# Altium project PX Logic to DS cable.PrjPcb
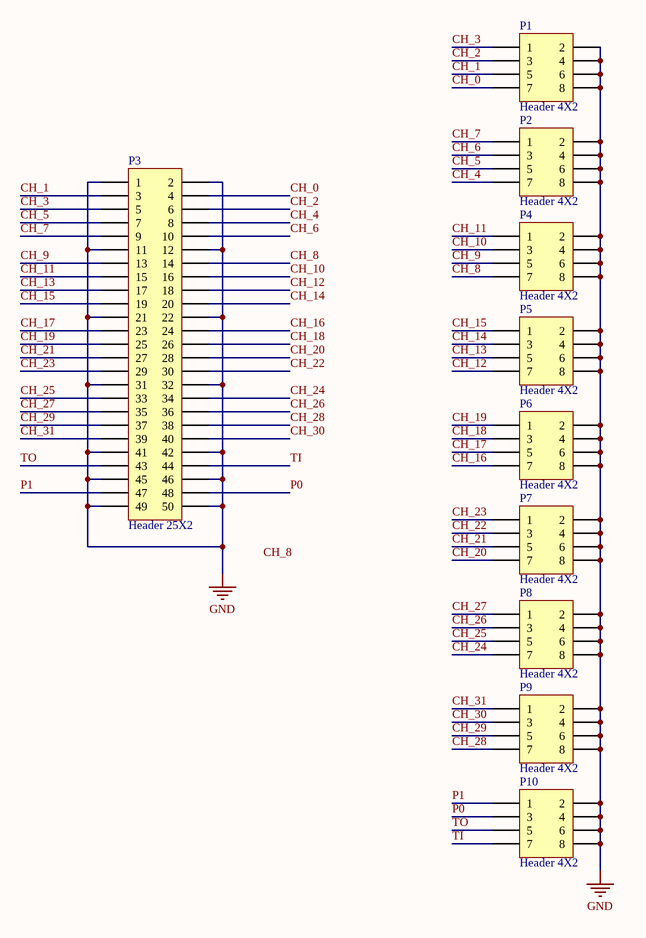
[diagram p0: Sheet1.SchDoc]
1 sheet, 10 parts. Net scope: global (net labels, ports and power ports of the same name join across sheets).
Board file: PCB1.PcbDoc

## Sheet Sheet1.SchDoc
size A4; SheetNumber: 1; SheetTotal: 1

### Parts
P1  Header 4X2  [HDR-2*4-1.27-SMD]
P2  Header 4X2  [HDR-2*4-1.27-SMD]
P3  Header 25X2  [HDR-2*25-2.54-SMD]
P4  Header 4X2  [HDR-2*4-1.27-SMD]
P5  Header 4X2  [HDR-2*4-1.27-SMD]
P6  Header 4X2  [HDR-2*4-1.27-SMD]
P7  Header 4X2  [HDR-2*4-1.27-SMD]
P8  Header 4X2  [HDR-2*4-1.27-SMD]
P9  Header 4X2  [HDR-2*4-1.27-SMD]
P10  Header 4X2  [HDR-2*4-1.27-SMD]

### Nets
GND: P1.2 P1.4 P1.6 P1.8 P2.2 P2.4 P2.6 P2.8 P3.1 P3.2 P3.11 P3.12 P3.21 P3.22 P3.31 P3.32 P3.41 P3.42 P3.45 P3.46 P3.49 P3.50 P4.2 P4.4 P4.6 P4.8 P5.2 P5.4 P5.6 P5.8 P6.2 P6.4 P6.6 P6.8 P7.2 P7.4 P7.6 P7.8 P8.2 P8.4 P8.6 P8.8 P9.2 P9.4 P9.6 P9.8 P10.2 P10.4 P10.6 P10.8
CH_0: P1.7 P3.4
CH_1: P1.5 P3.3
CH_2: P1.3 P3.6
CH_3: P1.1 P3.5
CH_4: P2.7 P3.8
CH_5: P2.5 P3.7
CH_6: P2.3 P3.10
CH_7: P2.1 P3.9
CH_8: P3.14 P4.7
CH_9: P3.13 P4.5
CH_10: P3.16 P4.3
CH_11: P3.15 P4.1
CH_12: P3.18 P5.7
CH_13: P3.17 P5.5
CH_14: P3.20 P5.3
CH_15: P3.19 P5.1
CH_16: P3.24 P6.7
CH_17: P3.23 P6.5
CH_18: P3.26 P6.3
CH_19: P3.25 P6.1
CH_20: P3.28 P7.7
CH_21: P3.27 P7.5
CH_22: P3.30 P7.3
CH_23: P3.29 P7.1
CH_24: P3.34 P8.7
CH_25: P3.33 P8.5
CH_26: P3.36 P8.3
CH_27: P3.35 P8.1
CH_28: P3.38 P9.7
CH_29: P3.37 P9.5
CH_30: P3.40 P9.3
CH_31: P3.39 P9.1
P0: P3.48 P10.3
P1: P3.47 P10.1
TI: P3.44 P10.7
TO: P3.43 P10.5

### Notes on the sheet
- Labels drawn without touching a wire or pin: CH_8

### Library data of the parts
P1 P2 P4-P10 = Header 4X2: Header, 4-Pin, Dual row; LatestRevisionDate: 17-Jul-2002; LatestRevisionNote: Re-released for DXP Platform.; Publisher: Altium Limited
P3 = Header 25X2: Header, 25-Pin, Dual row; LatestRevisionDate: 17-Jul-2002; LatestRevisionNote: Re-released for DXP Platform.; Publisher: Altium Limited